# EAGLE design Walletv3 (EAGLE 9.1.3)

## Sheet 1 of 3
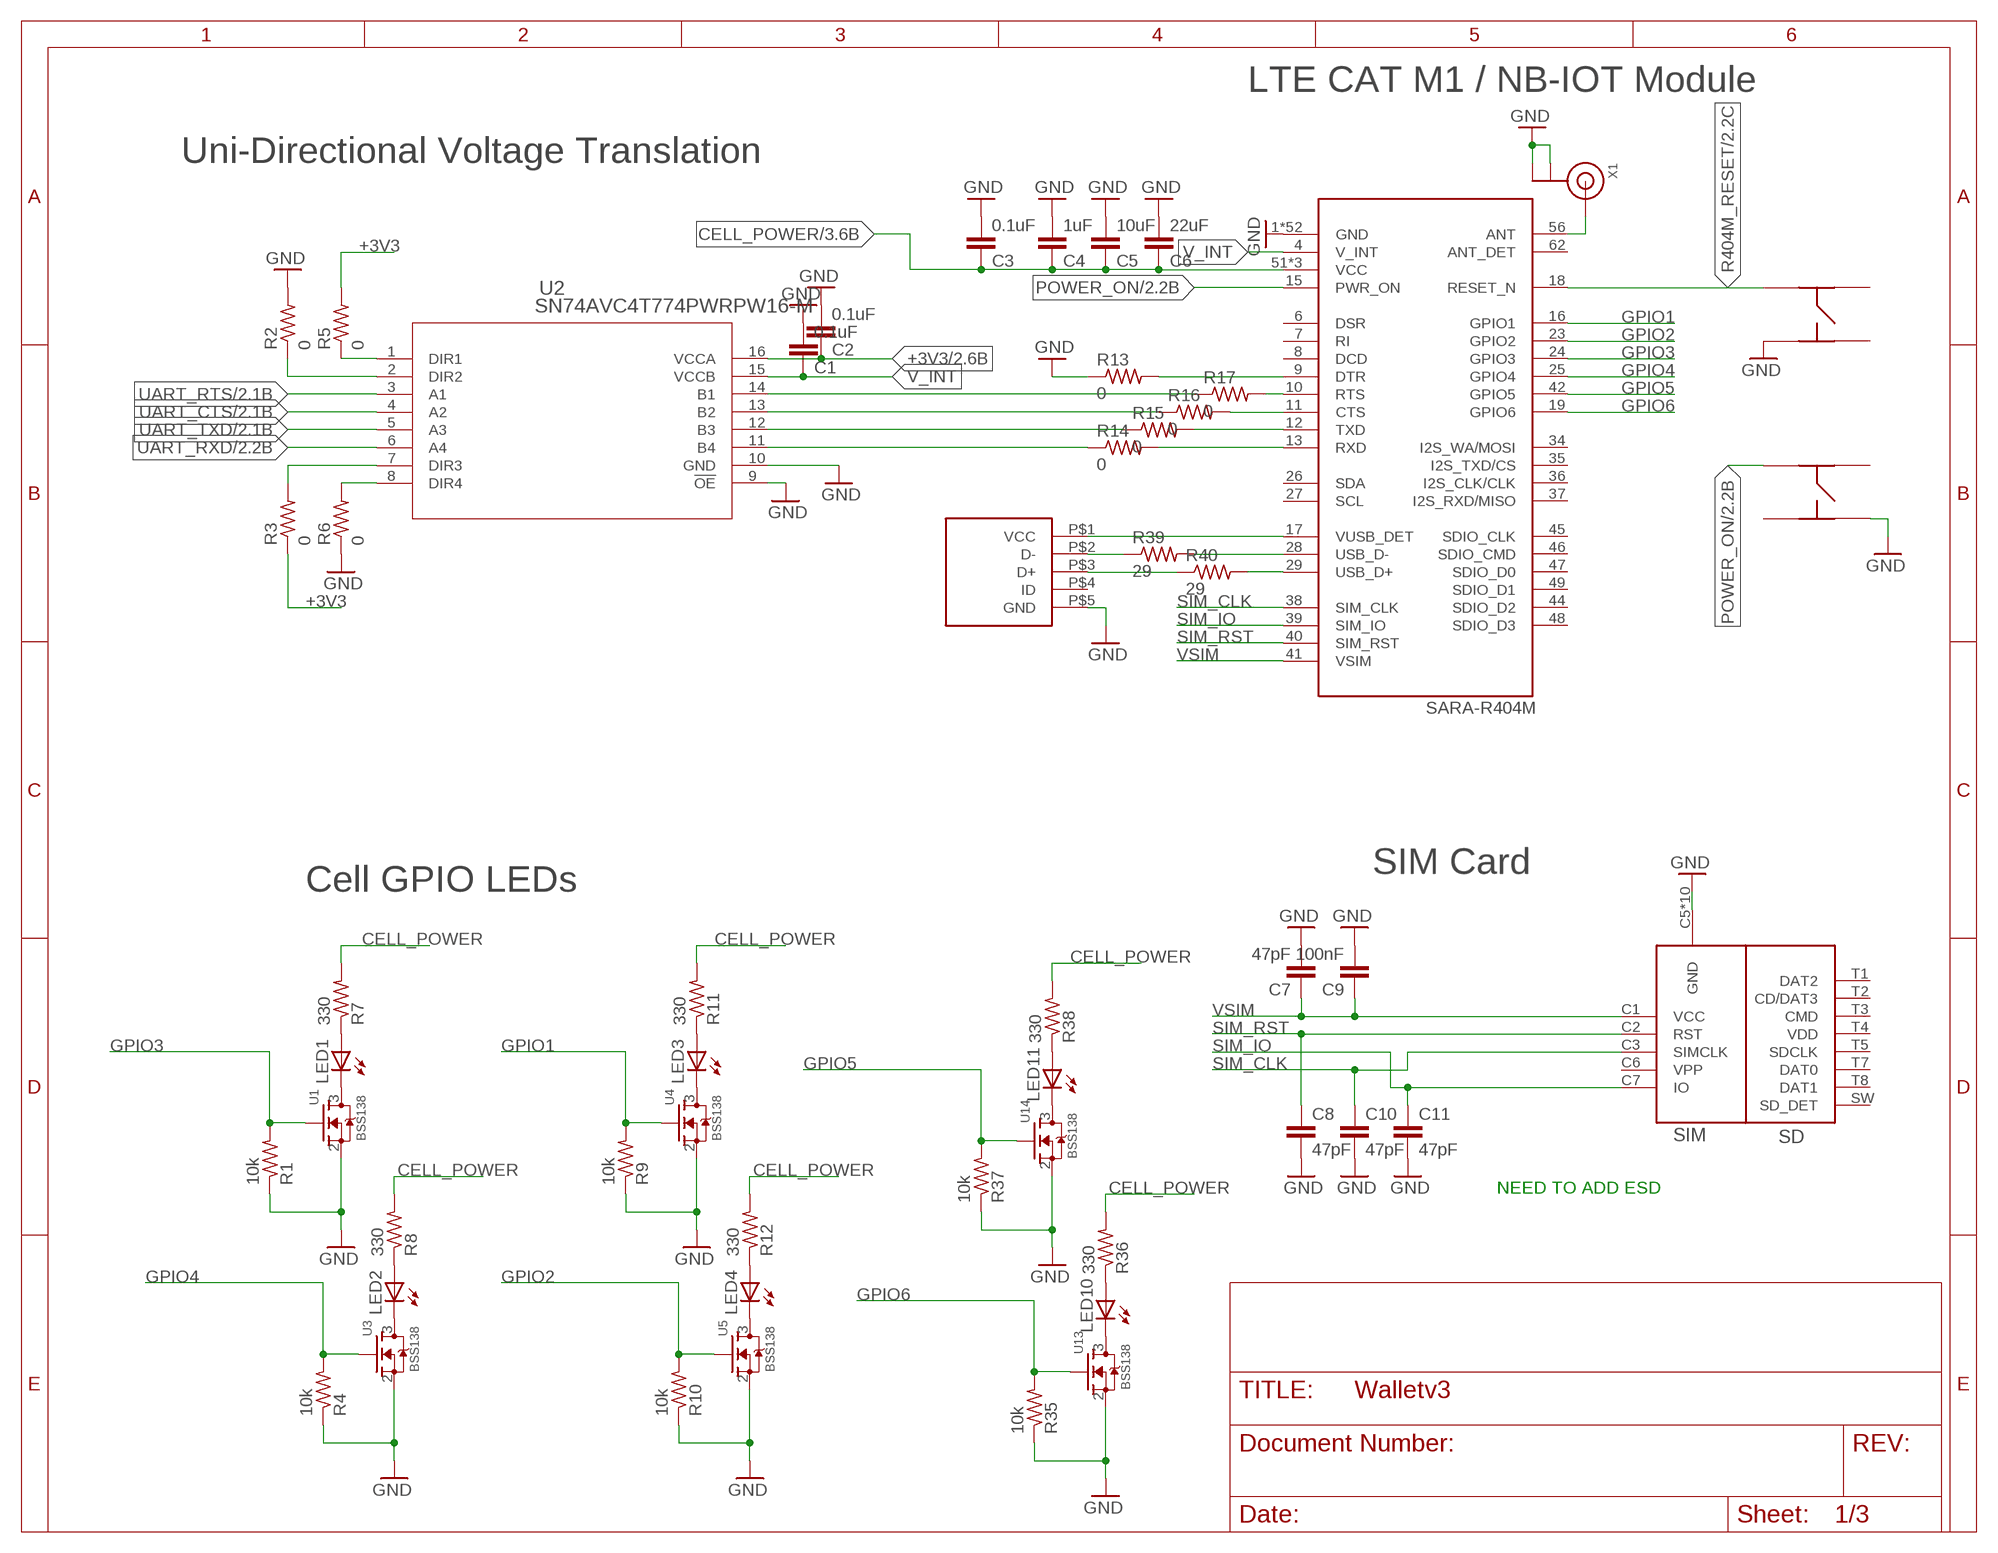
[diagram p0: schematic, sheet 1]

### Parts
C1  0.1uF  C-EUC0402  [C0402]
C2  0.1uF  C-EUC0402  [C0402]
C3  0.1uF  C-EUC0402  [C0402]
C4  1uF  C-EUC0402  [C0402]
C5  10uF  C-EUC0603  [C0603]
C6  22uF  C-EUC0805  [C0805]
C7  47pF  C-EUC0402  [C0402]
C8  47pF  C-EUC0402  [C0402]
C9  100nF  C-EUC0402  [C0402]
C10  47pF  C-EUC0402  [C0402]
C11  47pF  C-EUC0402  [C0402]
LED1  LEDCHIPLED_0603  [CHIPLED_0603]
LED2  LEDCHIPLED_0603  [CHIPLED_0603]
LED3  LEDCHIPLED_0603  [CHIPLED_0603]
LED4  LEDCHIPLED_0603  [CHIPLED_0603]
LED10  LEDCHIPLED_0603  [CHIPLED_0603]
LED11  LEDCHIPLED_0603  [CHIPLED_0603]
R1  10k  R-US_R0402  [R0402]
R2  0  R-US_R0402  [R0402]
R3  0  R-US_R0402  [R0402]
R4  10k  R-US_R0402  [R0402]
R5  0  R-US_R0402  [R0402]
R6  0  R-US_R0402  [R0402]
R7  330  R-US_R0402  [R0402]
R8  330  R-US_R0402  [R0402]
R9  10k  R-US_R0402  [R0402]
R10  10k  R-US_R0402  [R0402]
R11  330  R-US_R0402  [R0402]
R12  330  R-US_R0402  [R0402]
R13  0  R-US_R0402  [R0402]
R14  0  R-US_R0402  [R0402]
R15  0  R-US_R0402  [R0402]
R16  0  R-US_R0402  [R0402]
R17  0  R-US_R0402  [R0402]
R35  10k  R-US_R0402  [R0402]
R36  330  R-US_R0402  [R0402]
R37  10k  R-US_R0402  [R0402]
R38  330  R-US_R0402  [R0402]
R39  29  R-US_R0402  [R0402]
R40  29  R-US_R0402  [R0402]
S1  KMR731NG  [KMR731NG]
S2  KMR731NG  [KMR731NG]
U1  BSS138  [SOT23-3]
U2  SN74AVC4T774PWRPW16-M  [PW16-M]
U3  BSS138  [SOT23-3]
U4  BSS138  [SOT23-3]
U5  BSS138  [SOT23-3]
U6  SARA-R404M  [SARA-R404M]
U13  BSS138  [SOT23-3]
U14  BSS138  [SOT23-3]
U$1  SIM_SD_MOLEX  [SIM_SD_MOLEX]
U$2  MICRO_USB  [MOLEX_USB]
X1  ANTENNA_U.FL  [U.FL]

### Nets
+3V3: C2.1 R3.1 R5.2 U2.16(VCCA) ; also sheet 2,3
CELL_POWER: C3.1 C4.1 C5.1 C6.1 R7.2 R8.2 R11.2 R12.2 R36.2 R38.2 U6.51(VCC) U6.52(VCC) U6.53(VCC) ; also sheet 3
GND: C1.2 C2.2 C3.2 C4.2 C5.2 C6.2 C7.2 C8.2 C9.2 C10.2 C11.2 R1.1 R2.2 R4.1 R6.1 R9.1 R10.1 R13.1 R35.1 R37.1 S1.P$4 S2.P$3 U1.2(S) U2.9(!OE) U2.10(GND) U3.2(S) U4.2(S) U5.2(S) U6.1(GND) U6.3(GND) U6.5(GND) U6.14(GND) U6.20(GND) U6.21(GND) U6.22(GND) U6.30(GND) U6.32(GND) U6.43(GND) U6.50(GND) U6.54(GND) U6.55(GND) U6.57(GND) U6.58(GND) U6.59(GND) U6.60(GND) U6.61(GND) U6.63(GND) U6.64(GND) U6.65(GND) U6.66(GND) U6.67(GND) U6.68(GND) U6.69(GND) U6.70(GND) U6.71(GND) U6.72(GND) U6.73(GND) U6.74(GND) U6.75(GND) U6.76(GND) U6.77(GND) U6.78(GND) U6.79(GND) U6.80(GND) U6.81(GND) U6.82(GND) U6.83(GND) U6.84(GND) U6.85(GND) U6.86(GND) U6.87(GND) U6.88(GND) U6.89(GND) U6.90(GND) U6.91(GND) U6.92(GND) U6.93(GND) U6.94(GND) U6.95(GND) U6.96(GND) U13.2(S) U14.2(S) U$1.C5(GND) U$1.G1(GND) U$1.G2(GND) U$1.G3(GND) U$1.G4(GND) U$1.G5(GND) U$1.G6(GND) U$1.G7(GND) U$1.G8(GND) U$1.T6(GND) U$2.P$5(GND) X1.1(GND) X1.2(GND) ; also sheet 2,3
GPIO1: R9.2 U4.1(G) U6.16(GPIO1)
GPIO2: R10.2 U5.1(G) U6.23(GPIO2)
GPIO3: R1.2 U1.1(G) U6.24(GPIO3)
GPIO4: R4.2 U3.1(G) U6.25(GPIO4)
GPIO5: R37.2 U6.42(GPIO5) U14.1(G)
GPIO6: R35.2 U6.19(GPIO6) U13.1(G)
N$1: U6.17(VUSB_DET) U$2.P$1(VCC)
N$2: R39.1 U$2.P$2(D-)
N$3: R40.1 U$2.P$3(D+)
N$4: LED1.C U1.3(D)
N$5: R2.1 U2.2(DIR2)
N$6: LED1.A R7.1
N$7: R15.2 U6.12(TXD)
N$8: R14.2 U6.13(RXD)
N$9: LED4.C U5.3(D)
N$11: LED4.A R12.1
N$12: U6.56(ANT) X1.3(SIGNAL)
N$13: R13.2 U6.9(DTR)
N$14: LED2.C U3.3(D)
N$15: LED2.A R8.1
N$17: LED3.C U4.3(D)
N$18: R16.2 U6.11(CTS)
N$19: R17.2 U6.10(RTS)
N$21: LED3.A R11.1
N$27: R17.1 U2.14(B1)
N$28: R16.1 U2.13(B2)
N$29: R15.1 U2.12(B3)
N$30: R14.1 U2.11(B4)
N$31: R5.1 U2.1(DIR1)
N$32: R3.2 U2.7(DIR3)
N$33: R6.2 U2.8(DIR4)
N$50: LED10.C U13.3(D)
N$51: LED10.A R36.1
N$52: LED11.C U14.3(D)
N$53: LED11.A R38.1
N$54: R39.2 U6.28(USB_D-)
N$55: R40.2 U6.29(USB_D+)
POWER_ON: S2.P$1 U6.15(PWR_ON) ; also sheet 2
R404M_RESET: S1.P$1 U6.18(RESET_N) ; also sheet 2
SIM_CLK: C10.1 U6.38(SIM_CLK) U$1.C3(SIMCLK)
SIM_IO: C11.1 U6.39(SIM_IO) U$1.C7(IO)
SIM_RST: C8.1 U6.40(SIM_RST) U$1.C2(RST)
UART_CTS: U2.4(A2) ; also sheet 2
UART_RTS: U2.3(A1) ; also sheet 2
UART_RXD: U2.6(A4) ; also sheet 2
UART_TXD: U2.5(A3) ; also sheet 2
V_INT: C1.1 U2.15(VCCB) U6.4(V_INT)
VSIM: C7.1 C9.1 U6.41(VSIM) U$1.C1(VCC)
Unconnected: S1.P$2 S1.P$3 S2.P$2 S2.P$4 U6.6(DSR) U6.7(RI) U6.8(DCD) U6.26(SDA) U6.27(SCL) U6.34(I2S_WA/MOSI) U6.35(I2S_TXD/CS) U6.36(I2S_CLK/CLK) U6.37(I2S_RXD/MISO) U6.44(SDIO_D2) U6.45(SDIO_CLK) U6.46(SDIO_CMD) U6.47(SDIO_D0) U6.48(SDIO_D3) U6.49(SDIO_D1) U6.62(ANT_DET) U$1.C6(VPP) U$1.SW(SD_DET) U$1.T1(DAT2) U$1.T2(CD/DAT3) U$1.T3(CMD) U$1.T4(VDD) U$1.T5(SDCLK) U$1.T7(DAT0) U$1.T8(DAT1) U$2.P$4(ID)

### Notes on the sheet
- LTE CAT M1 / NB-IOT Module
- Uni-Directional Voltage Translation
- SIM Card
- Cell GPIO LEDs
- NEED TO ADD ESD

## Sheet 2 of 3
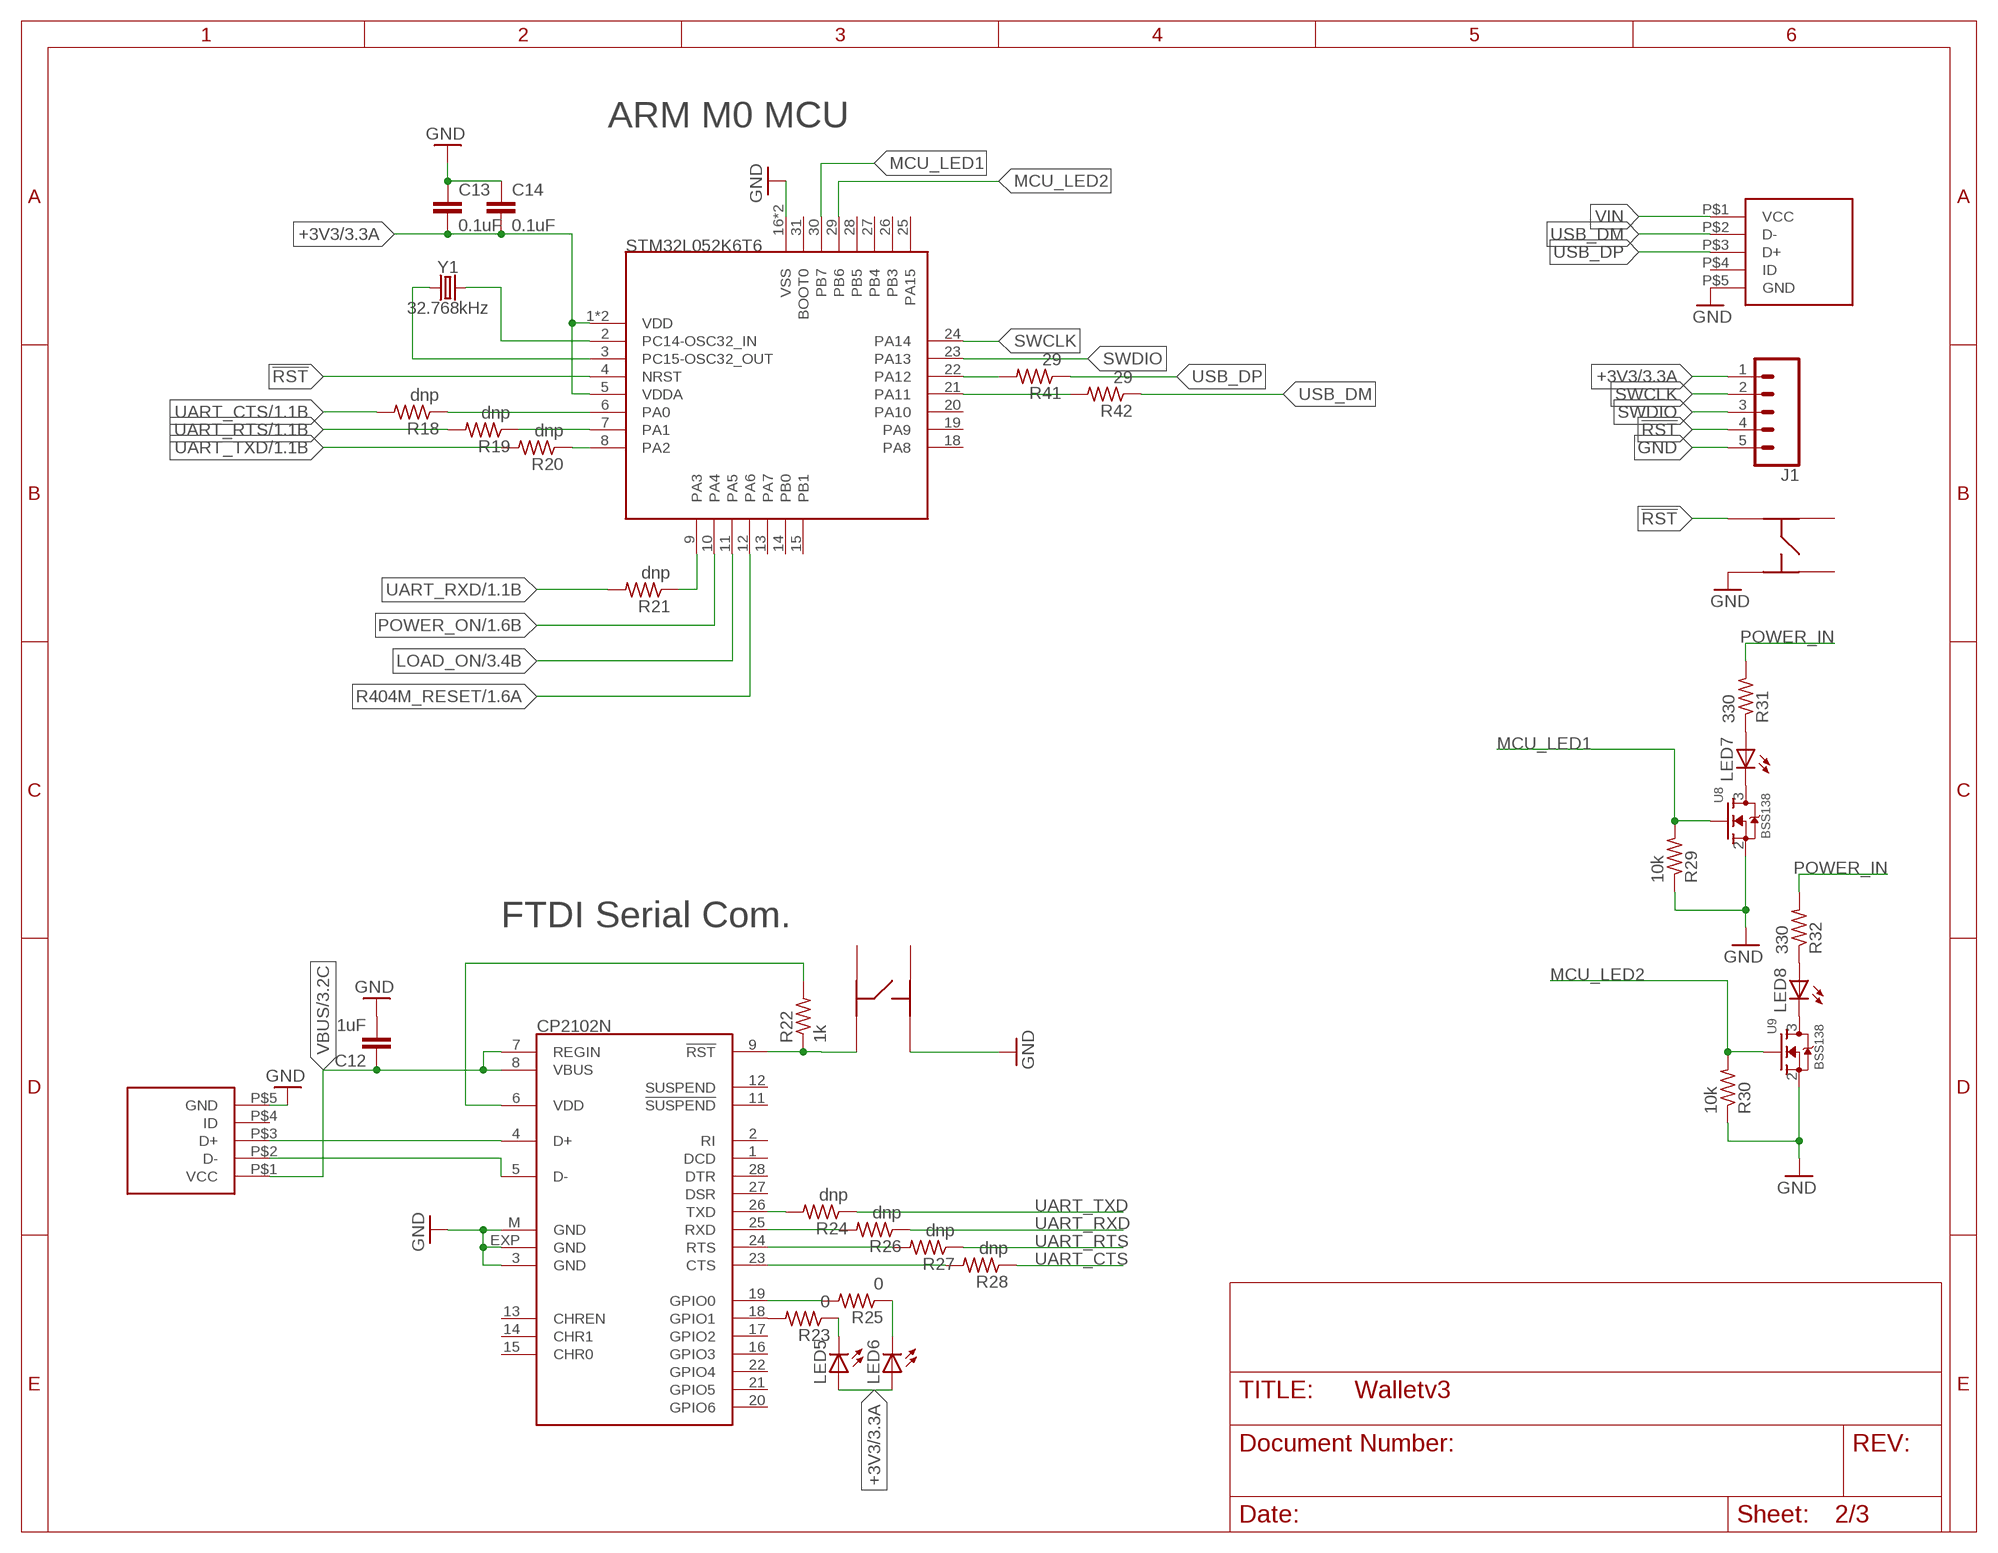
[diagram p1: schematic, sheet 2]

### Parts
C12  1uF  C-EUC0402  [C0402]
C13  0.1uF  C-EUC0402  [C0402]
C14  0.1uF  C-EUC0402  [C0402]
IC1  CP2102  [MLP28]
J1  CONN_05  [1X05]
LED5  LEDCHIPLED_0603  [CHIPLED_0603]
LED6  LEDCHIPLED_0603  [CHIPLED_0603]
LED7  LEDCHIPLED_0603  [CHIPLED_0603]
LED8  LEDCHIPLED_0603  [CHIPLED_0603]
R18  dnp  R-US_R0402  [R0402]
R19  dnp  R-US_R0402  [R0402]
R20  dnp  R-US_R0402  [R0402]
R21  dnp  R-US_R0402  [R0402]
R22  1k  R-US_R0402  [R0402]
R23  0  R-US_R0402  [R0402]
R24  dnp  R-US_R0402  [R0402]
R25  0  R-US_R0402  [R0402]
R26  dnp  R-US_R0402  [R0402]
R27  dnp  R-US_R0402  [R0402]
R28  dnp  R-US_R0402  [R0402]
R29  10k  R-US_R0402  [R0402]
R30  10k  R-US_R0402  [R0402]
R31  330  R-US_R0402  [R0402]
R32  330  R-US_R0402  [R0402]
R41  29  R-US_R0402  [R0402]
R42  29  R-US_R0402  [R0402]
S3  KMR731NG  [KMR731NG]
S4  KMR731NG  [KMR731NG]
U7  STM32L052K6T6LQFP32-7X7  [QFP80P900X900X160-32]
U8  BSS138  [SOT23-3]
U9  BSS138  [SOT23-3]
U$3  MICRO_USB  [MOLEX_USB]
U$4  MICRO_USB  [MOLEX_USB]
Y1  32.768kHz  CRYSTAL-32.768KHZSMD-3.2X1.5  [CRYSTAL-SMD-3.2X1.5MM]

### Nets
!RST: J1.4 S4.P$1 U7.4(NRST)
+3V3: C13.2 C14.2 J1.1 LED5.A LED6.A U7.1(VDD) U7.5(VDDA) U7.17(VDD) ; also sheet 1,3
D_N: IC1.5(D-) U$3.P$2(D-)
D_P: IC1.4(D+) U$3.P$3(D+)
GND: C12.2 C13.1 C14.1 IC1.3(GND) IC1.EXP(GND) IC1.M(GND) J1.5 R29.1 R30.1 S3.P$4 S4.P$4 U7.16(VSS) U7.32(VSS) U8.2(S) U9.2(S) U$3.P$5(GND) U$4.P$5(GND) ; also sheet 1,3
LOAD_ON: U7.11(PA5) ; also sheet 3
MCU_LED1: R29.2 U7.30(PB7) U8.1(G)
MCU_LED2: R30.2 U7.29(PB6) U9.1(G)
N$10: LED7.C U8.3(D)
N$16: LED7.A R31.1
N$23: LED8.C U9.3(D)
N$26: LED8.A R32.1
N$34: IC1.9(!RST) R22.1 S3.P$1
N$35: IC1.6(VDD) R22.2
N$36: LED6.C R25.1
N$37: IC1.18(GPIO1) R23.2
N$38: LED5.C R23.1
N$39: IC1.19(GPIO0) R25.2
N$40: IC1.26(TXD) R24.2
N$41: IC1.25(RXD) R26.2
N$42: R18.1 U7.6(PA0)
N$43: R19.1 U7.7(PA1)
N$44: IC1.24(RTS) R27.2
N$45: IC1.23(CTS) R28.2
N$46: R20.1 U7.8(PA2)
N$47: R21.1 U7.9(PA3)
N$48: U7.2(PC14-OSC32_IN) Y1.P$2
N$49: U7.3(PC15-OSC32_OUT) Y1.P$1
N$56: R41.2 U7.22(PA12)
N$57: R42.2 U7.21(PA11)
POWER_IN: R31.2 R32.2 ; also sheet 3
POWER_ON: U7.10(PA4) ; also sheet 1
R404M_RESET: U7.12(PA6) ; also sheet 1
SWCLK: J1.2 U7.24(PA14)
SWDIO: J1.3 U7.23(PA13)
UART_CTS: R18.2 R28.1 ; also sheet 1
UART_RTS: R19.2 R27.1 ; also sheet 1
UART_RXD: R21.2 R26.1 ; also sheet 1
UART_TXD: R20.2 R24.1 ; also sheet 1
USB_DM: R42.1 U$4.P$2(D-)
USB_DP: R41.1 U$4.P$3(D+)
VBUS: C12.1 IC1.7(REGIN) IC1.8(VBUS) U$3.P$1(VCC) ; also sheet 3
VIN: U$4.P$1(VCC)
Unconnected: IC1.1(DCD) IC1.2(RI) IC1.11(!SUSPEND) IC1.12(SUSPEND) IC1.13(CHREN) IC1.14(CHR1) IC1.15(CHR0) IC1.16(GPIO3) IC1.17(GPIO2) IC1.20(GPIO6) IC1.21(GPIO5) IC1.22(GPIO4) IC1.27(DSR) IC1.28(DTR) S3.P$2 S3.P$3 S4.P$2 S4.P$3 U7.13(PA7) U7.14(PB0) U7.15(PB1) U7.18(PA8) U7.19(PA9) U7.20(PA10) U7.25(PA15) U7.26(PB3) U7.27(PB4) U7.28(PB5) U7.31(BOOT0) U$3.P$4(ID) U$4.P$4(ID)

### Notes on the sheet
- ARM M0 MCU
- FTDI Serial Com.

## Sheet 3 of 3
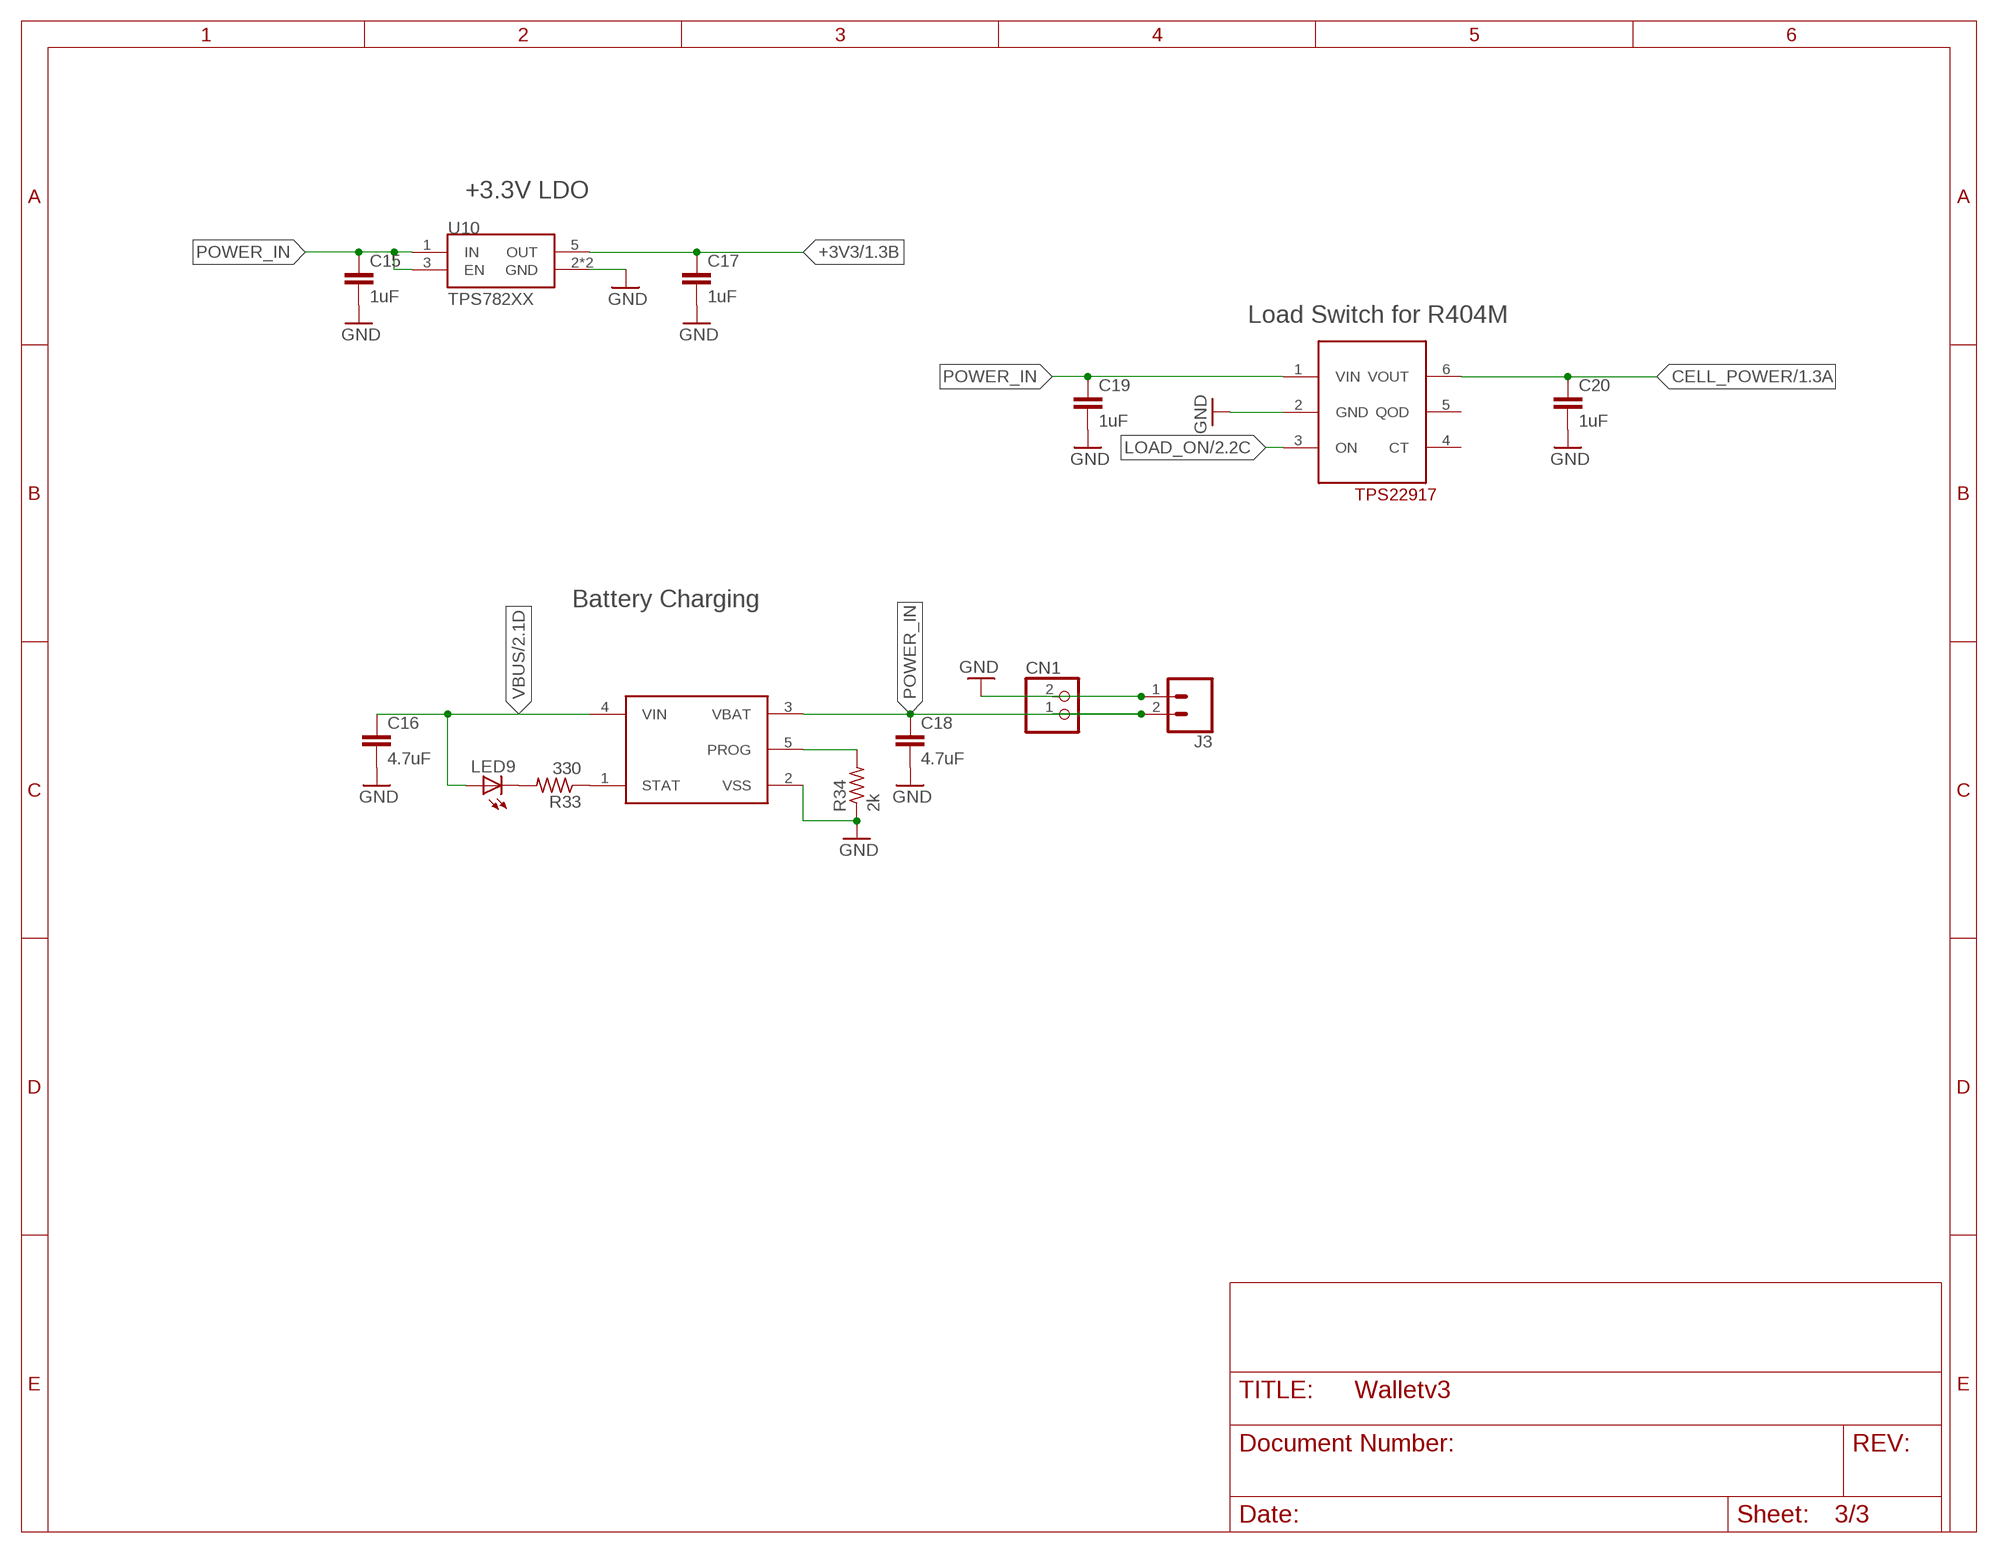
[diagram p2: schematic, sheet 3]

### Parts
C15  1uF  C-EUC0402  [C0402]
C16  4.7uF  C-EUC0603  [C0603]
C17  1uF  C-EUC0402  [C0402]
C18  4.7uF  C-EUC0603  [C0603]
C19  1uF  C-EUC0402  [C0402]
C20  1uF  C-EUC0402  [C0402]
CN1  JST_2PIN-SMT-RA  [JST-PH-2-SMT-RA]
J3  CONN_02  [1X02]
LED9  LEDCHIP-LED0603  [CHIP-LED0603]
R33  330  R-US_R0402  [R0402]
R34  2k  R-US_R0402  [R0402]
U10  TPS782XX  [SOT23-5L]
U11  MCP73831  [SOT23-5L]
U12  TPS22917  [SOT23-6]

### Nets
+3V3: C17.1 U10.5(OUT) ; also sheet 1,2
CELL_POWER: C20.1 U12.6(VOUT) ; also sheet 1
GND: C15.2 C16.2 C17.2 C18.2 C19.2 C20.2 CN1.2 J3.1 R34.1 U10.2(GND) U10.4(GND) U11.2(VSS) U12.2(GND) ; also sheet 1,2
LOAD_ON: U12.3(ON) ; also sheet 2
N$22: R34.2 U11.5(PROG)
N$24: R33.1 U11.1(STAT)
N$25: LED9.C R33.2
POWER_IN: C15.1 C18.1 C19.1 CN1.1 J3.2 U10.1(IN) U10.3(EN) U11.3(VBAT) U12.1(VIN) ; also sheet 2
VBUS: C16.1 LED9.A U11.4(VIN) ; also sheet 2
Unconnected: U12.4(CT) U12.5(QOD)

### Notes on the sheet
- +3.3V LDO
- Load Switch for R404M
- Battery Charging

## Library data of the parts
C1-C20 = rcl:C-EU: CAPACITOR, European symbol; SPICEPREFIX: C
CN1 = adafruit:JST_2PIN: JST 2-Pin Connectors of various flavors SMT-RA (S2B-PH-SM4) 4UConnector #17311 SMT (B2B-PH-SM4) THM-RA (S2B-PH) THM (B2B-PH)
IC1 = silabs:CP210*: Single-Chip USB to UART Bridge Source: www.silabs.com .. CP2101.pdf / cp2102.pdf; MF: FARNELL; MPN: CP2102-GM; OC_FARNELL: 9282130; OC_NEWARK: 30K5635
J1 = SparkFun-Connectors:CONN_05: Multi connection point. Often used as Generic Header-pin footprint for 0.1 inch spaced/style header connections On any of the 0.1 inch spaced packages, you can populate with these: Break Away Headers - Straight <https://www.sparkfun.com/products/116> (PRT-00116) Break Away Male Headers - Right Angle <https://www.sparkfun.com/products/553> (PRT-00553) Female Headers <https://www.sparkfun.com/products/115> (PRT-00115) Break Away Headers - Machine Pin <https://www.sparkfun.com/products/117> (PRT-00117) Break Away Female Headers - Swiss Machine Pin <https://www.sparkfun.com/products/743> (PRT-00743) For SCREWTERMINALS and SPRING TERMINALS visit here: Screw Terimnals on SparkFun.com <https://www.sparkfun.com/search/results?term=Screw+Terminals> (5mm/3.5mm/2.54mm spacing) This device is also useful as a general connection point to wire up your design to another part of your project. Our various solder wires solder well into these plated through hole pads. Hook-Up Wire - Assortment (Stranded, 22 AWG) <https://www.sparkfun.com/products/11375> (PRT-11375) Hook-Up Wire - Assortment (Solid Core, 22 AWG) <https://www.sparkfun.com/products/11367> (PRT-11367) View the entire wire category on our website here <https://www.sparkfun.com/categories/141> Special notes: Molex polarized connector foot print use with SKU : PRT-08231 with associated crimp pins and housings. 1MM SMD Version SKU: PRT-10208
J3 = SparkFun-Connectors:CONN_02: Multi connection point. Often used as Generic Header-pin footprint for 0.1 inch spaced/style header connections On any of the 0.1 inch spaced packages, you can populate with these: Break Away Headers - Straight <https://www.sparkfun.com/products/116> (PRT-00116) Break Away Male Headers - Right Angle <https://www.sparkfun.com/products/553> (PRT-00553) Female Headers <https://www.sparkfun.com/products/115> (PRT-00115) Break Away Headers - Machine Pin <https://www.sparkfun.com/products/117> (PRT-00117) Break Away Female Headers - Swiss Machine Pin <https://www.sparkfun.com/products/743> (PRT-00743) For SCREWTERMINALS and SPRING TERMINALS visit here: Screw Terimnals on SparkFun.com <https://www.sparkfun.com/search/results?term=Screw+Terminals> (5mm/3.5mm/2.54mm spacing) This device is also useful as a general connection point to wire up your design to another part of your project. Our various solder wires solder well into these plated through hole pads. Hook-Up Wire - Assortment (Stranded, 22 AWG) <https://www.sparkfun.com/products/11375> (PRT-11375) Hook-Up Wire - Assortment (Solid Core, 22 AWG) <https://www.sparkfun.com/products/11367> (PRT-11367) View the entire wire category on our website here <https://www.sparkfun.com/categories/141> Special notes: Molex polarized connector foot print use with: PRT-08233 with associated crimp pins and housings. 2.54_SCREWTERM for use with PRT-10571. 3.5mm Screw Terminal footprints for PRT-08084 5mm Screw Terminal footprints for use with PRT-08432
LED1-LED11 = adafruit:LED: LED OSRAM: - CHIPLED LG R971, LG N971, LY N971, LG Q971, LY Q971, LO R971, LY R971 LH N974, LH R974 LS Q976, LO Q976, LY Q976 LO Q996 - Hyper CHIPLED LW Q18S LB Q993, LB Q99A, LB R99A - SideLED LS A670, LO A670, LY A670, LG A670, LP A670 LB A673, LV A673, LT A673, LW A673 LH A674 LY A675 LS A676, LA A676, LO A676, LY A676, LW A676 LS A679, LY A679, LG A679 - Hyper Micro SIDELED® LS Y876, LA Y876, LO Y876, LY Y876 LT Y87S - SmartLED LW L88C, LW L88S LB L89C, LB L89S, LG L890 LS L89K, LO L89K, LY L89K LS L896, LA L896, LO L896, LY L896 - TOPLED LS T670, LO T670, LY T670, LG T670, LP T670 LSG T670, LSP T670, LSY T670, LOP T670, LYG T670 LG T671, LOG T671, LSG T671 LB T673, LV T673, LT T673, LW T673 LH T674 LS T676, LA T676, LO T676, LY T676, LB T676, LH T676, LSB T676, LW T676 LB T67C, LV T67C, LT T67C, LS T67K, LO T67K, LY T67K, LW E67C LS E67B, LA E67B, LO E67B, LY E67B, LB E67C, LV E67C, LT E67C LW T67C LS T679, LY T679, LG T679 LS T770, LO T770, LY T770, LG T770, LP T770 LB T773, LV T773, LT T773, LW T773 LH T774 LS E675, LA E675, LY E675, LS T675 LS T776, LA T776, LO T776, LY T776, LB T776 LHGB T686 LT T68C, LB T68C - Hyper Mini TOPLED® LB M676 - Mini TOPLED Santana® LG M470 LS M47K, LO M47K, LY M47K Source: http://www.osram.convergy.de/
R1-R42 = rcl:R-US_: RESISTOR, American symbol; SPICEPREFIX: R
S1-S4 = Charles:KMR731NG: Tactile Switch SPST-NO Top Actuated Surface Mount
U1 U3-U5 U8 U9 U13 U14 = Charles:BSS138: MOSFET N-CH 50V 220MA
U2 = Charles:SN74AVC4T774PWR: 4-Bit Dual-Supply Bus Transceiver With Configurable Voltage Translation and 3-State Outputs; MANUFACTURER_PART_NUMBER: SN74AVC4T774PWR; VENDOR: Texas Instruments
U6 = Charles:SARA-R404M
U7 = Charles:STM32L052K6T6: ARM® Cortex®-M0+ STM32L0 Microcontroller IC 32-Bit 32MHz 32KB (32K x 8) FLASH 32-LQFP (7x7)
U10 = James_Updated:TPS782XX: TPS782 500-nA IQ,150-mA, Ultra-Low Quiescent Current Low-Dropout Linear Regulator
U11 = James_Updated:MCP73831
U12 = Charles:TPS22917: 1 V–5.5-V, 2-A, 80-mΩ Ultra-Low Leakage Load Switch
U$1 = Charles:SIM_SD_MOLEX
U$2-U$4 = James_Updated:MICRO_USB: Molex Micro USB AB RA SMD Bottom Mount
X1 = adafruit:ANTENNA_U.FL: U.FL Antenna Connector
Y1 = SparkFun-Clocks:CRYSTAL-32.768KHZ: 32.768kHz Crystal Frequency: 32.768kHz Frequency Stability: ±20ppm Load Capacitance: 12.5pF (PTH-2X6 & SMD-3.2X1.5), 6pF (SMD-2X6) SparkFun Products: SparkFun BigTime Watch Kit <https://www.sparkfun.com/products/11734> SparkFun nRF52832 Breakout <https://www.sparkfun.com/products/13990> SparkFun Real Time Clock Module <https://www.sparkfun.com/products/12708>; PROD_ID: XTAL-13062

## Board
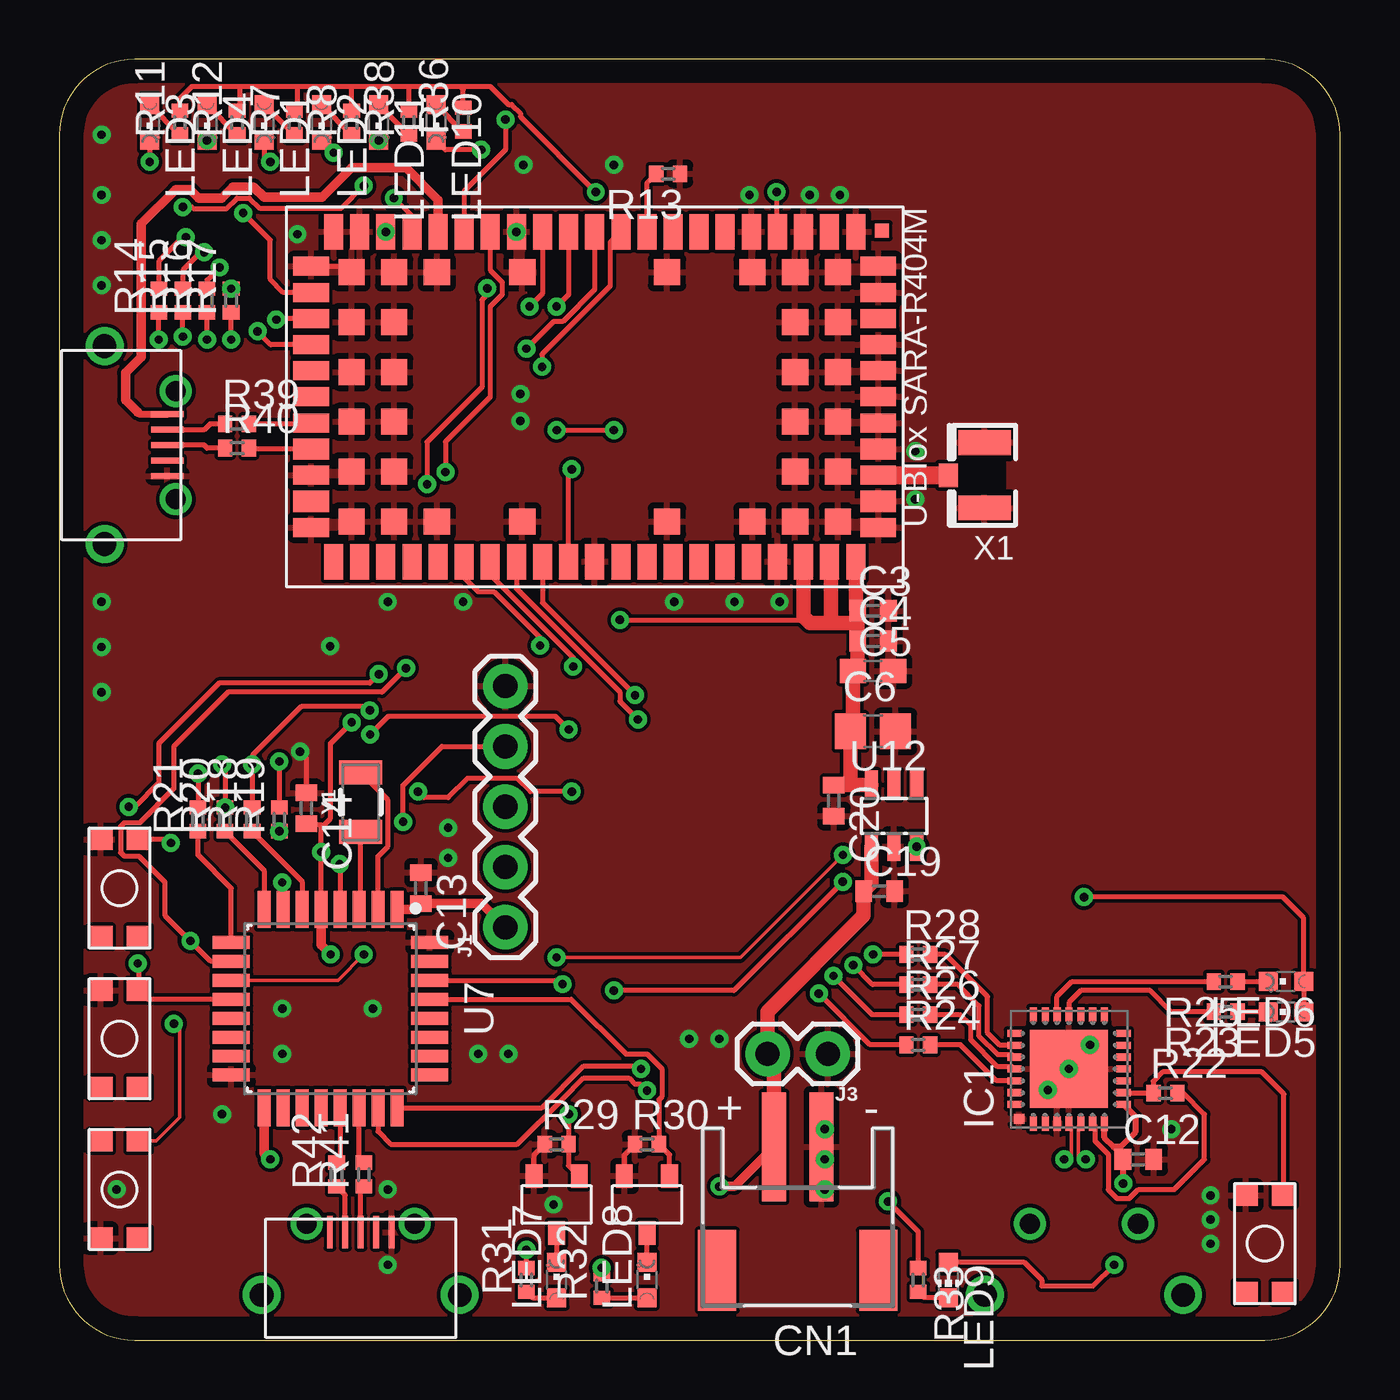
[diagram p3: board, top side]
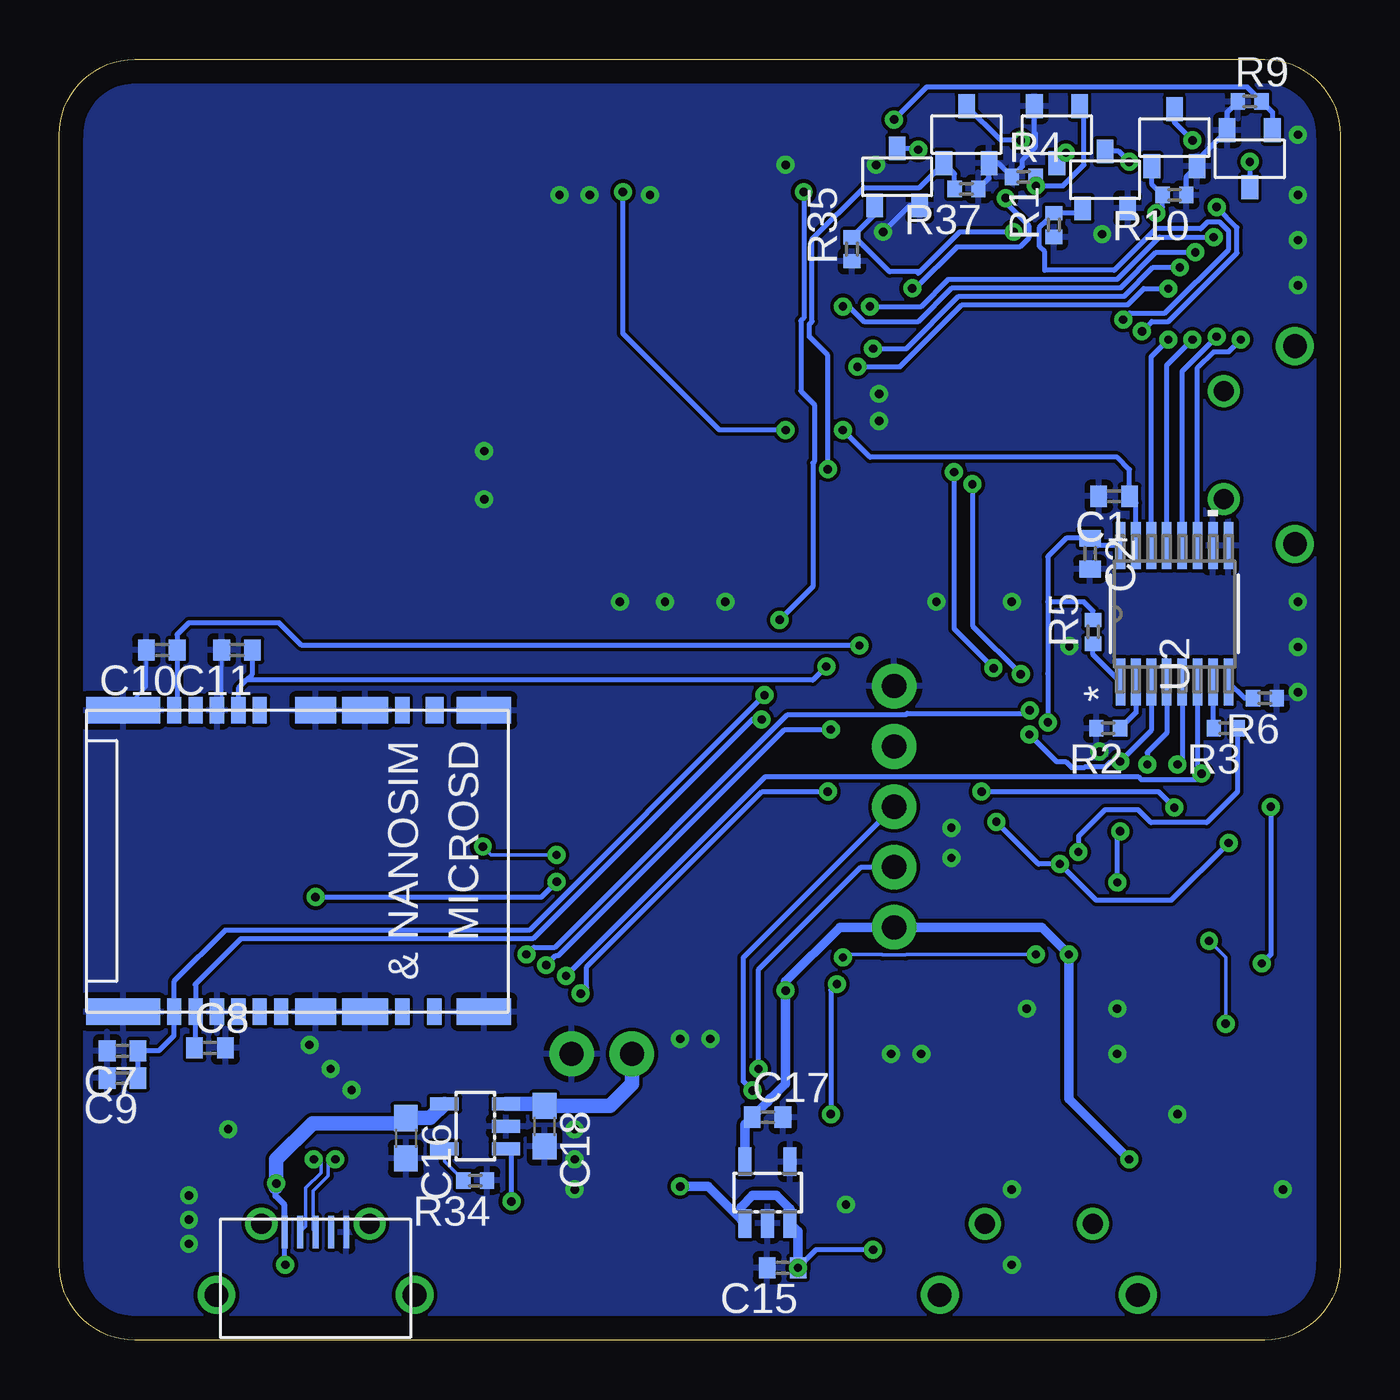
[diagram p4: board, bottom side, seen from below]

Size 53.98 x 53.98 mm. Coordinates in mm from the lower left corner, seen from the top.
Outline: 3.17,0 50.8,0 arc90 53.98,3.17 53.98,50.8 arc90 50.8,53.98 3.17,53.98 arc90 0,50.8 0,3.17 arc90 3.17,0
Copper layers (1*16): Top 0.035mm / dielectric 1.5mm / Bottom 0.035mm
Design rules "default": minimum track width 6mil, minimum drill 0.35mm, track to track 6mil, track to pad 6mil, pad to pad 6mil, via to via 6mil, smd to smd 6mil, copper to edge 40mil, drill to drill 6mil, minimum pad ring 10mil, minimum via ring 8mil, stop-mask expansion 4mil, vias tented up to drill 0mil, thermal gap 10mil

### Footprints (pad centres in the part's own frame; a part is rotated, then mirrored left to right if it is on the bottom)
C0402 = smd 0.7 x 0.9: 1 -0.65,0; 2 0.65,0
C0603 = smd 1.1 x 1: 1 -0.85,0; 2 0.85,0
C0805 = smd 1.3 x 1.5: 1 -0.95,0; 2 0.95,0
JST-PH-2-SMT-RA = smd 1 x 4.6: 1 1,-3.7; 2 -1,-3.7 | smd 1.6 x 3.4: NC1 -3.4,1.5; NC2 3.4,1.5
MLP28 = smd 0.6 x 0.3: 1 -2.3,1.5; 2 -2.3,1; 3 -2.3,0.5; 4 -2.3,0; 5 -2.3,-0.5; 6 -2.3,-1; 7 -2.3,-1.5; 15 2.3,-1.5; 16 2.3,-1; 17 2.3,-0.5; 18 2.3,0; 19 2.3,0.5; 20 2.3,1; 21 2.3,1.5 | smd 0.3 x 0.6: 8 -1.5,-2.3; 9 -1,-2.3; 10 -0.5,-2.3; 11 0,-2.3; 12 0.5,-2.3; 13 1,-2.3; 14 1.5,-2.3; 22 1.5,2.3; 23 1,2.3; 24 0.5,2.3; 25 0,2.3; 26 -0.5,2.3; 27 -1,2.3; 28 -1.5,2.3 | smd 3.3 x 3.3: EXP 0,0 | smd 0.435 x 0.435: M -2.103,2.103
1X05 = drill 1.016 pad 1.88: 1 0,0; 2 2.54,0; 3 5.08,0; 4 7.62,0; 5 10.16,0
1X02 = drill 1.016 pad 1.88: 1 0,0; 2 2.54,0
CHIPLED_0603 = smd 0.8 x 0.8: A 0,-0.75; C 0,0.75
CHIP-LED0603 = smd 0.8 x 0.8: A 0,-0.75; C 0,0.75
R0402 = smd 0.6 x 0.7: 1 -0.5,0; 2 0.5,0
KMR731NG = smd 0.9 x 1: P$1 -2.05,0.8; P$2 2.05,0.8; P$3 2.05,-0.8; P$4 -2.05,-0.8
SOT23-3 = smd 0.7 x 1: 1 -0.95,-1.2; 2 0.95,-1.2; 3 0,1.2
PW16-M = smd 1.981 x 0.406: 1 -2.87,2.275; 2 -2.87,1.625; 3 -2.87,0.975; 4 -2.87,0.325; 5 -2.87,-0.325; 6 -2.87,-0.975; 7 -2.87,-1.625; 8 -2.87,-2.275; 9 2.87,-2.275; 10 2.87,-1.625; 11 2.87,-0.975; 12 2.87,-0.325; 13 2.87,0.325; 14 2.87,0.975; 15 2.87,1.625; 16 2.87,2.275
SARA-R404M = smd 1.5 x 0.8: 1 1.05,-2; 2 1.05,-3.1; 3 1.05,-4.2; 4 1.05,-5.3; 5 1.05,-6.4; 6 1.05,-7.5; 7 1.05,-8.6; 8 1.05,-9.7; 9 1.05,-10.8; 10 1.05,-11.9; 11 1.05,-13; 12 1.05,-14.1; 13 1.05,-15.2; 14 1.05,-16.3; 15 1.05,-17.4; 16 1.05,-18.5; 17 1.05,-19.6; 18 1.05,-20.7; 19 1.05,-21.8; 20 1.05,-22.9; 21 1.05,-24; 33 14.95,-24; 34 14.95,-22.9; 35 14.95,-21.8; 36 14.95,-20.7; 37 14.95,-19.6; 38 14.95,-18.5; 39 14.95,-17.4; 40 14.95,-16.3; 41 14.95,-15.2; 42 14.95,-14.1; 43 14.95,-13; 44 14.95,-11.9; 45 14.95,-10.8; 46 14.95,-9.7; 47 14.95,-8.6; 48 14.95,-7.5; 49 14.95,-6.4; 50 14.95,-5.3; 51 14.95,-4.2; 52 14.95,-3.1; 53 14.95,-2 | smd 0.8 x 1.5: 22 2.5,-24.95; 23 3.6,-24.95; 24 4.7,-24.95; 25 5.8,-24.95; 26 6.9,-24.95; 27 8,-24.95; 28 9.1,-24.95; 30 11.3,-24.95; 32 13.5,-24.95; 54 13.5,-1.05; 56 11.3,-1.05; 58 9.1,-1.05; 59 8,-1.05; 60 6.9,-1.05; 61 5.8,-1.05; 62 4.7,-1.05; 63 3.6,-1.05; 64 2.5,-1.05 | smd 0.9 x 1.5: 29 10.2,-24.95; 31 12.4,-24.95; 55 12.4,-1.05; 57 10.2,-1.05 | smd 1.1 x 1.1: 65 2.75,-2.75; 66 4.85,-2.75; 67 6.95,-2.75; 68 9.05,-2.75; 69 11.15,-2.75; 70 13.25,-2.75; 71 2.75,-4.55; 72 4.85,-4.55; 73 6.95,-4.55; 74 9.05,-4.55; 75 11.15,-4.55; 76 13.25,-4.55; 77 2.75,-6.35; 78 13.25,-6.35; 79 2.75,-9.95; 80 13.25,-9.95; 81 2.75,-16.05; 82 13.25,-16.05; 83 2.75,-19.65; 84 13.25,-19.65; 85 2.75,-21.45; 86 4.85,-21.45; 87 6.95,-21.45; 88 9.05,-21.45; 89 11.15,-21.45; 90 13.25,-21.45; 91 2.75,-23.25; 92 4.85,-23.25; 93 6.95,-23.25; 94 9.05,-23.25; 95 11.15,-23.25; 96 13.25,-23.25 | smd 0.6 x 0.6: P$1 1,-0.9
QFP80P900X900X160-32 = smd 1.559 x 0.547: 1 -4.178,2.8; 2 -4.178,2; 3 -4.178,1.2; 4 -4.178,0.4; 5 -4.178,-0.4; 6 -4.178,-1.2; 7 -4.178,-2; 8 -4.178,-2.8; 17 4.178,-2.8; 18 4.178,-2; 19 4.178,-1.2; 20 4.178,-0.4; 21 4.178,0.4; 22 4.178,1.2; 23 4.178,2; 24 4.178,2.8 | smd 0.547 x 1.559: 9 -2.8,-4.178; 10 -2,-4.178; 11 -1.2,-4.178; 12 -0.4,-4.178; 13 0.4,-4.178; 14 1.2,-4.178; 15 2,-4.178; 16 2.8,-4.178; 25 2.8,4.178; 26 2,4.178; 27 1.2,4.178; 28 0.4,4.178; 29 -0.4,4.178; 30 -1.2,4.178; 31 -2,4.178; 32 -2.8,4.178
SOT23-5L = smd 0.55 x 1.2: 1 -0.95,-1.3; 2 0,-1.3; 3 0.95,-1.3; 4 0.95,1.3; 5 -0.95,1.3
SOT23-6 = smd 0.55 x 1.2: 1 -0.95,-1.3; 2 0,-1.3; 3 0.95,-1.3; 4 0.95,1.3; 5 0,1.3; 6 -0.95,1.3
SIM_SD_MOLEX = smd 1.1 x 0.6: C1 6.35,3.7; C2 6.35,4.6; C3 -6.35,3.7; C5 6.35,5.5; C6 -6.35,4.6; C7 -6.35,6.4; T1 6.35,14.665; T2 6.35,13.31; T3 6.35,8.2; T4 6.35,7.3; T5 6.35,6.4; T6 -6.35,5.5; T7 -6.35,7.3; T8 -6.35,13.31 | smd 1.1 x 3.1: G1 -6.35,1.55; G8 6.35,1.55 | smd 1.1 x 1.72: G2 -6.35,9.66; G7 6.35,9.66 | smd 1.1 x 1.94: G3 -6.35,11.74; G6 6.35,11.74 | smd 1.1 x 2.3: G4 -6.35,16.75; G5 6.35,16.75 | smd 1.1 x 0.75: SW -6.35,14.665
MOLEX_USB = smd 0.25 x 1.35: P$1 -1.3,2.65; P$2 -0.65,2.65; P$3 0,2.65; P$4 0.65,2.65; P$5 1.3,2.65 | drill 0.85 pad 1.206: P$6 -2.276,3; P$7 2.276,3 | drill 1 pad 1.6: P$8 -4.175,0; P$9 4.175,0
U.FL = smd 2.2 x 1.05: 1 0,1.375; 2 0,-1.375 | smd 0.8 x 1: 3 1.525,0
CRYSTAL-SMD-3.2X1.5MM = smd 1 x 1.8: P$1 -1.25,0; P$2 1.25,0

### Placement (x,y rotation side)
C1  9.53,35.56 180 bottom
C2  10.54,33.15 270 bottom
C3  34.29,30.73 0 top
C4  34.29,29.46 0 top
C5  34.29,28.19 0 top
C6  34.29,25.65 0 top
C7  51.31,12.19 180 bottom
C8  47.62,12.32 0 bottom
C9  51.31,11.05 180 bottom
C10  49.66,29.08 180 bottom
C11  46.48,29.08 180 bottom
C12  45.47,7.62 0 top
C13  15.24,19.05 270 top
C14  10.41,22.42 270 top
C15  23.5,3.05 180 bottom
C16  39.37,8.51 270 bottom
C17  24.13,9.4 0 bottom
C18  33.53,9.02 270 bottom
C19  34.54,18.92 0 top
C20  32.64,22.73 270 top
CN1  31.11,4.45 180 top
IC1  42.55,11.43 90 top
J1  18.8,17.4 90 top
J3  32.38,12.06 180 top
LED1  8.64,51.31 180 top
LED2  11.05,51.31 180 top
LED3  3.81,51.31 180 top
LED4  6.22,51.31 180 top
LED5  51.69,13.84 90 top
LED6  51.69,15.11 90 top
LED7  20.95,2.54 0 top
LED8  24.77,2.54 0 top
LED9  37.47,2.54 180 top
LED10  15.88,51.31 180 top
LED11  13.46,51.31 180 top
R1  12.06,46.99 90 bottom
R2  9.78,25.78 180 bottom
R3  4.83,25.78 180 bottom
R4  13.34,49.02 0 bottom
R5  10.41,29.84 90 bottom
R6  3.17,27.05 180 bottom
R7  9.91,51.31 90 top
R8  12.32,51.31 90 top
R9  3.81,52.2 0 bottom
R10  6.99,48.26 180 bottom
R11  5.08,51.31 90 top
R12  7.49,51.31 90 top
R13  25.65,49.15 180 top
R14  4.19,43.81 90 top
R15  5.21,43.81 90 top
R16  6.22,43.81 90 top
R17  7.24,43.81 90 top
R18  8.13,21.94 90 top
R19  9.27,21.94 90 top
R20  6.99,21.94 90 top
R21  5.84,21.94 90 top
R22  46.61,10.41 0 top
R23  49.15,13.84 180 top
R24  36.2,12.45 0 top
R25  49.15,15.11 180 top
R26  36.2,13.72 0 top
R27  36.2,14.99 0 top
R28  36.2,16.26 0 top
R29  20.95,8.26 0 top
R30  24.77,8.26 0 top
R31  19.68,2.54 90 top
R32  22.86,2.29 90 top
R33  36.2,2.54 270 top
R34  36.45,6.73 180 bottom
R35  20.57,45.97 90 bottom
R36  17.02,51.44 90 top
R37  15.75,48.51 180 bottom
R38  14.73,51.31 90 top
R39  7.49,38.61 0 top
R40  7.49,37.59 0 top
R41  12.83,6.99 90 top
R42  11.68,6.99 90 top
S1  2.54,12.7 270 top
S2  2.54,6.35 270 top
S3  50.8,4.06 270 top
S4  2.54,19.05 270 top
U1  9.91,48.9 0 bottom
U2  6.99,30.61 90 bottom
U3  11.94,50.8 180 bottom
U4  3.81,49.78 180 bottom
U5  6.99,50.67 0 bottom
U6  35.56,47.75 270 top
U7  11.43,13.97 270 top
U8  20.95,5.71 180 top
U9  24.77,5.71 180 top
U10  24.13,6.22 0 bottom
U11  36.45,9.02 90 bottom
U12  35.18,22.1 0 top
U13  18.67,49.02 0 bottom
U14  15.75,50.8 0 bottom
U$1  52.83,20.19 270 bottom
U$2  1.91,37.72 270 top
U$3  43.18,1.91 0 bottom
U$4  12.7,1.91 0 top
X1  38.99,36.45 180 top
Y1  12.7,22.67 90 top

### Tracks (layer width: path | path; a pad name or v marks a point on that pad's centre or on a via)
!RST  (via drill 0.35)
  Top 0.203: U7.4 11.83,20.05 v11.81,20.07 | v4.7,20.95 4.55,21.1 S4.P$1 | v14.49,21.84 14.49,22.85 14.48,22.85 14.48,23.38 16.12,25.02 J1.4
  Bottom 0.203: v4.7,20.95 7.11,18.54 10.29,18.54 v11.81,20.07 12.71,20.07 v14.49,21.84
+3V3  (via drill 0.35)
  Top 0.203: U7.5 v11.03,20.57 11.03,21.59 | 11.03,21.59 11.03,21.72 10.46,21.72 C14.2 | 15.12,18.28 C13.2 | LED5.A LED6.A 52.44,17.79 51.56,18.67 v43.18,18.67 | v33.01,19.32 28.43,14.73 v23.37,14.73 | 11.03,21.59 11.43,21.99 11.43,25.15 v12.32,26.04
  Top 0.406: C13.2 17.8,18.4 J1.1 | U7.1 14.99,18.15 15.12,18.28 | U7.5 11.03,16.66 v11.43,16.26 | U7.17 8.63,7.88 v8.89,7.62
  Bottom 0.203: U2.16 10.22,33.48 C2.1 11.54,33.8 12.32,33.02 12.32,31.11 | v43.18,18.67 33.66,18.67 v33.01,19.32 | 12.32,31.11 12.32,28.07 12.31,28.07 v12.31,26.04 v12.32,26.04 | R3.1 4.33,23.11 5.62,21.81 7.97,21.81 8.51,22.35 9.91,22.35 11.03,21.23 v11.03,20.57 | R5.2 10.41,30.73 10.79,31.11 12.32,31.11
  Bottom 0.406: U10.5 25.08,9.1 C17.1 24.19,9.99 23.98,10.2 23.97,10.2 23.37,10.81 v23.37,14.73 23.37,15.11 21.08,17.4 J1.1 12.57,17.4 v11.43,16.26 11.43,10.16 v8.89,7.62
CELL_POWER  (via drill 0.35)
  Top 0.203: R11.2 5.08,52.32 5.59,52.83 7.62,52.83 | 7.62,52.83 10.03,52.83 | 10.03,52.83 12.32,52.83 | 12.32,52.83 14.73,52.83 | 14.73,52.83 16.89,52.83 | 16.89,52.83 18.16,52.83 18.93,52.07 19.06,52.07 19.43,51.7 19.43,51.56 v22.61,48.39 | R36.2 17.02,52.7 16.89,52.83 | R38.2 14.73,52.83 | R8.2 12.32,52.83 | R7.2 10.03,51.94 10.03,52.83 | R12.2 7.62,51.94 7.62,52.83 | v23.62,30.35 31.22,30.35 31.36,30.49
  Top 0.61: U12.6 33.4,23.4 | 33.4,23.4 32.65,23.4 C20.1 | C6.1 33.34,25.15 | 33.34,25.15 33.34,23.46 33.4,23.4 | 33.34,25.15 33.44,25.25 C5.1 33.64,28.39 C4.1 33.64,30.23 | 33.64,30.23 C3.1 33.56,30.81 U6.53 | U6.51 31.36,30.49 31.62,30.23 32.51,30.23 | 32.51,30.23 33.64,30.23 | U6.52 32.51,32.75 32.51,30.23
  Bottom 0.203: v22.61,48.39 22.61,43.07 22.73,42.95 22.73,40 22.16,39.43 22.16,37.03 22.22,36.97 22.22,31.75 v23.62,30.35
D_N  (via drill 0.35)
  Top 0.152: v43.25,7.62 42.95,7.62 42.95,9.04 IC1.5
  Bottom 0.152: U$3.P$2 43.59,4.8 43.59,6.41 42.95,7.05 42.95,7.62 v43.25,7.62
D_P  (via drill 0.35)
  Top 0.152: v42.34,7.62 42.65,7.62 42.65,9.03 IC1.4
  Bottom 0.152: U$3.P$3 43.28,4.66 43.28,6.29 42.65,6.92 42.65,7.62 v42.34,7.62
GND  (via drill 0.35)
  Top 0.203: U9.2 23.82,7.8 R30.1 | U8.2 20,7.8 R29.1 | C14.1 10.41,24.53 v10.14,24.8 | U6.22 12.06,45.25 U6.91
  Bottom 0.152: U$1.G1 50.31,27.52 C10.2 | U$1.T6 47.13,26.74 C11.2
  Bottom 0.203: R37.1 14.8,48.96 U14.2 14.41,49.6 R4.1 13.39,49.47 13.39,49.74 12.83,50.3 12.83,50.82 12.89,50.88 U3.2 | R10.1 6.49,49.02 U5.2 6.04,49.71 U4.2 4.76,51.75 R9.1 | v10.14,24.8 10.16,24.78 10.16,24.77 | U6.14 18.14,47.82 U13.2
  other vias: 42.55,11.43 41.66,10.54 43.43,12.45 48.51,6.1 46.86,8.89 48.51,5.08 48.51,4.06 32.26,8.89 32.26,7.62 32.26,6.35 30.35,31.11 28.45,31.11 25.91,31.11 17.02,31.11 13.84,31.11 1.78,31.11 1.78,29.21 1.78,27.3 36.07,35.43 36.07,37.47 31.62,48.26 19.43,38.73 29.08,48.26 32.89,48.26 1.78,50.8 1.78,48.26 1.78,46.35 1.78,44.45 13.21,13.97 9.4,13.97 9.4,12.06 6.86,9.53 13.84,3.17 13.84,6.35 2.41,6.35 20.83,5.71 17.65,12.06 18.92,12.06 26.54,12.7 27.81,12.7 16.38,20.32 16.38,21.59 11.41,29.25 19.56,49.53 23.37,49.53 19.26,46.7 19.43,39.88 10.03,46.61
  pour Bottom: -1.65,54.23 55.5,54.23 55.5,-2.16 -2.79,-2.16 -2.79,53.85
  pour Top: -5.33,56.9 57.91,56.9 57.91,-3.3 -5.97,-3.3 -5.97,56.13
GPIO1  (via drill 0.35)
  Top 0.203: v18.8,51.44 18.8,50.16 17.06,48.43 U6.16
  Bottom 0.203: U4.1 2.86,51.75 R9.2 3.76,52.64 3.76,52.65 3.9,52.8 17.43,52.8 v18.8,51.44
GPIO2  (via drill 0.35)
  Top 0.203: U6.23 9.44,44.15 8.89,44.7 8.89,46.35 v7.75,47.5
  Bottom 0.203: U5.1 7.93,48.71 R10.2 7.49,47.76 v7.75,47.5
GPIO3  (via drill 0.35)
  Top 0.203: U6.24 9.19,43.05 v9.14,43.01
  Bottom 0.203: v9.14,43.01 8.87,43.28 7.38,43.28 4.7,45.96 4.7,46.74 5.07,47.11 5.6,47.11 5.87,46.84 7.77,46.84 9.52,45.09 12.45,45.09 12.45,45.86 12.67,46.09 12.67,46.9 12.52,47.04 12.51,47.04 R1.2 11.06,47.49 U1.1
GPIO4  (via drill 0.35)
  Top 0.203: U6.25 8.91,41.95 v8.35,42.51 | v5.21,47.75 5.6,47.75 5.67,47.68 7.03,47.68 7.49,48.13 8.01,48.13 8.43,47.71 11.89,47.71 v12.83,48.64
  Bottom 0.203: v8.35,42.51 7.94,42.93 7.23,42.93 4.35,45.81 4.35,46.89 v5.21,47.75 | v5.21,47.75 | R4.2 v12.84,48.65 v12.83,48.64 11.68,48.64 10.79,49.53 10.79,51.81 U3.1
GPIO5  (via drill 0.35)
  Top 0.203: U6.42 21.46,36.57 v21.59,36.7
  Bottom 0.203: R37.2 16.25,49.15 U14.1 17.72,48.58 20.07,48.58 22.25,46.4 22.25,42.92 22.37,42.81 22.37,42.28 21.59,41.5 v21.59,36.7
GPIO6  (via drill 0.35)
  Bottom 0.203: U6.19 16.04,46.7 17.72,45.02 | 17.72,45.02 17.78,44.96 | R35.2 20.51,46.54 | 20.51,46.54 19.62,47.43 U13.1 | 17.72,45.02 18.99,45.02 20.51,46.54
  other vias: 13.76,46.7
LOAD_ON  (via drill 0.35)
  Top 0.152: U7.11 11.74,15.17 v12.83,16.26 | v20.95,16.13 28.7,16.13 v33.02,20.45
  Bottom 0.152: v20.95,16.13 20.83,16.26 19.3,16.26 19.28,16.23 18.31,16.23 18.29,16.26 v12.83,16.26 | v33.02,20.45 35.78,20.45 U12.3
  other vias: 36.13,20.8
MCU_LED1  (via drill 0.35)
  Top 0.203: U7.30 21.04,15.17 v21.21,15 | v21.46,9.53 21.46,8.26 R29.2 21.45,7.37 U8.1
  Bottom 0.203: v21.21,15 21.46,14.75 v21.46,9.53
MCU_LED2
  Top 0.203: U7.29 21.57,14.37 23.88,12.06 24.77,12.06 25.4,11.44 25.4,10.26 25.27,10.13 R30.2 25.71,7.81 U9.1
N$1
  Top 0.203: U$2.P$1
  Top 0.305: 3.3,39.12 3.41,39.01 U$2.P$1
  Top 0.406: U6.17 15.96,48.05 14.61,49.4 13.97,49.4 12.32,49.4 11.08,48.16 8.62,48.16 8.2,48.59 7.3,48.59 6.84,48.13 5.86,48.13 5.51,48.49 4.9,48.49 3.46,47.04 3.46,41.43 2.79,40.77 2.79,39.62 3.3,39.12
N$2
  Top 0.203: R39.1 6.35,38.61 6.1,38.35 4.57,38.35 U$2.P$2
N$3
  Top 0.203: R40.1 6.22,37.59 6.1,37.72 U$2.P$3
N$4  (via drill 0.35)
  Top 0.203: LED1.C 8.64,49.91 v8.89,49.66
  Bottom 0.203: v8.89,49.66 9.33,50.09 U1.3
N$5
  Bottom 0.203: U2.2 8.61,26.45 R2.1
N$6
  Top 0.203: LED1.A 9.89,50.81 R7.1
N$7  (via drill 0.35)
  Top 0.203: U6.12 21.46,44.07 v20.95,43.56 | v6.1,45.84 5.96,45.84 5.21,45.09 R15.2
  Bottom 0.203: v20.95,43.56 20.71,43.56 20.07,42.93 17.78,42.93 16.36,44.35 9.25,44.35 7.76,45.84 v6.1,45.84
N$8  (via drill 0.35)
  Top 0.203: U6.13 20.36,44.11 v19.81,43.56 | v5.33,46.48 5.27,46.55 4.19,45.47 R14.2
  Bottom 0.203: v19.81,43.56 17.65,43.56 16.51,44.7 9.4,44.7 7.62,46.48 v5.33,46.48
N$9  (via drill 0.35)
  Bottom 0.203: LED4.C 6.99,51.32 U5.3
  other vias: 6.22,50.56
N$10
  Top 0.203: U8.3 LED7.C
N$11
  Top 0.203: LED4.A 7.47,50.81 R12.1
N$12
  Top 0.762: U6.56 X1.3
N$13
  Top 0.203: U6.9 24.76,48.76 R13.2
N$14  (via drill 0.35)
  Top 0.203: v11.56,50.04 v11.56,50.05 LED2.C
  Bottom 0.203: v11.56,50.04 11.56,49.98 U3.3
N$15
  Top 0.203: LED2.A 12.3,50.81 R8.1
N$16
  Top 0.203: R31.1 19.93,1.79 LED7.A
N$17  (via drill 0.35)
  Top 0.203: LED3.C v3.81,49.66
  Bottom 0.203: v3.81,49.66 U4.3
N$18  (via drill 0.35)
  Top 0.203: v19.68,41.78 20.83,42.93 21.22,42.93 22.56,44.27 U6.11 | v6.76,45.21 6.22,44.67 R16.2
  Bottom 0.203: v19.68,41.78 18.29,41.78 16.08,43.99 10.67,43.99 9.1,43.99 7.89,45.21 v6.76,45.21
N$19  (via drill 0.35)
  Top 0.203: U6.10 23.21,46.26 23.21,44.42 20.34,41.55 v20.34,41.02
  Bottom 0.203: R17.2 8.28,44.31 8.96,43.64 15.93,43.64 18.54,41.02 19.45,41.02 v20.34,41.02
  other vias: 7.24,44.31
N$21
  Top 0.203: LED3.A 5.06,50.81 R11.1
N$22
  Bottom 0.152: U11.5 37.75,7.53 R34.2
N$23
  Top 0.203: LED8.C U9.3
N$24  (via drill 0.35)
  Top 0.203: R33.1 36.2,4.57 v34.92,5.84
  Bottom 0.203: v34.92,5.84 34.92,7.84 U11.1
N$25
  Top 0.203: LED9.C 36.45,1.79 R33.2
N$26
  Top 0.203: R32.1 LED8.A
N$27  (via drill 0.35)
  Top 0.203: v7.24,42.16 R17.1
  Bottom 0.203: U2.14 7.96,41.44 v7.24,42.16
N$28  (via drill 0.35)
  Top 0.203: v6.22,42.16 v6.22,42.17 R16.1
  Bottom 0.203: U2.13 7.31,41.08 v6.22,42.16
N$29  (via drill 0.35)
  Top 0.203: v5.21,42.29 R15.1
  Bottom 0.203: U2.12 6.66,40.84 v5.21,42.29
N$30  (via drill 0.35)
  Top 0.203: v4.19,42.16 R14.1
  Bottom 0.203: U2.11 6.01,40.98 5.33,41.66 4.7,41.66 v4.19,42.16
N$31
  Bottom 0.203: U2.1 10.41,28.89 R5.1
N$32
  Bottom 0.203: U2.7 5.36,25.82 R3.2
N$33
  Bottom 0.203: U2.8 4.02,27.05 R6.2
N$34
  Top 0.203: IC1.9 46.09,10.43 | 46.09,10.43 R22.1 | S3.P$1 51.6,10.38 50.67,11.3 46.48,11.3 46.09,10.91 46.09,10.43
N$35
  Top 0.203: IC1.6 43.64,9.03 43.64,8.4 44.2,7.84 44.2,6.34 44.57,5.97 45.09,5.97 45.47,6.35 46.99,6.35 48.26,7.62 48.26,9.53 47.37,10.41 R22.2
N$36
  Top 0.203: R25.1 LED6.C
N$37
  Top 0.203: R23.2 46.86,13.84 45.97,14.73 43.05,14.73 42.55,14.22 IC1.18
N$38
  Top 0.203: LED5.C R23.1
N$39
  Top 0.203: IC1.19 42.05,14.49 42.67,15.11 R25.2
N$40
  Top 0.203: IC1.26 39.49,10.93 37.97,12.45 R24.2
N$41
  Top 0.203: R26.2 37.96,13.72 38.41,13.27 38.41,12.66 39.54,11.53 40.15,11.53 IC1.25
N$42
  Top 0.203: R18.1 10.23,19.34 U7.6
N$43  (via drill 0.35)
  Top 0.203: U7.7 9.39,18.19 v9.39,19.29
  Bottom 0.203: v9.39,19.29 9.39,21.33 R19.1
  other vias: 9.27,21.44
N$44
  Top 0.203: IC1.24 40.15,12.03 39.54,12.03 38.76,12.81 38.76,14.1 37.87,14.99 R27.2
N$45
  Top 0.203: IC1.23 39.64,12.43 39.12,12.95 39.12,14.48 37.34,16.26 R28.2
N$46
  Top 0.203: R20.1 8.63,19.8 U7.8
N$47
  Top 0.203: U7.9 7.25,19.04 5.84,20.45 R21.1
N$48
  Top 0.203: U7.2 13.43,20.39 13.85,20.81 13.85,22.76 Y1.P$2
N$49
  Top 0.203: U7.3 12.7,18.22 Y1.P$1
N$50  (via drill 0.35)
  Top 0.203: v17.78,50.16 16.27,50.16 LED10.C
  Bottom 0.203: U13.3 17.84,50.22 v17.78,50.16
N$51
  Top 0.203: LED10.A 17,50.94 R36.1
N$52  (via drill 0.35)
  Bottom 0.203: LED11.C 14.31,50.56 U14.3
  other vias: 13.46,50.56
N$53
  Top 0.203: LED11.A 14.71,50.81 R38.1
N$54
  Top 0.203: U6.28 10.57,38.61 R39.2
N$55
  Top 0.203: U6.29 8.03,37.55 R40.2
N$56
  Top 0.203: U7.22 12.63,7.68 R41.2
N$57
  Top 0.203: U7.21 11.83,7.63 R42.2
POWER_IN  (via drill 0.35)
  Top 0.203: R31.2 v19.68,3.81 | R32.2 22.84,2.8 v22.84,3.05
  Top 0.406: CN1.1 28.45,6.48 v27.81,6.48
  Top 0.61: CN1.1 30.11,11.79 J3.2 29.84,13.84 33.89,17.89 C19.1 34.23,19.26 U12.1
  Bottom 0.203: v19.68,3.81 22.08,3.81 v22.84,3.05
  Bottom 0.406: v27.81,6.48 26.63,6.48 25.25,5.1 | 25.25,5.1 U10.1 | 25.25,5.1 25.25,5.61 24.77,6.1 23.75,6.1 23.18,5.53 U10.3 22.84,4.59 v22.84,3.05
  Bottom 0.61: U11.3 33.63,9.97 C18.1 30.77,9.87 29.84,10.79 J3.2
POWER_ON  (via drill 0.35)
  Top 0.152: S2.P$1 4.08,8.4 5.08,9.4 5.08,13.08 v4.83,13.34
  Top 0.203: U6.15 18.16,45.09 18.67,44.59 18.67,44.06 18.16,43.55 18.16,39.75 16.27,37.86 v16.27,36.58 | v14.61,28.32 13.59,27.3 7.11,27.3 4.83,25.02 4.83,23.24 3.39,21.8 2.73,21.8 2.59,21.66 2.59,20.55 2.73,20.4 3.35,20.4 4.45,19.3 4.45,17.91 v5.52,16.83 6.38,15.97 U7.10
  Bottom 0.152: v4.83,13.34 4.83,16.13 v5.52,16.83
  Bottom 0.203: v16.27,36.58 16.27,29.98 v14.61,28.32
R404M_RESET  (via drill 0.35)
  Top 0.203: U7.12 3.72,14.37 S1.P$1 3.34,15.84 v3.3,15.88 | U6.18 14.86,47.37 v14.1,48.13 | v18.03,44.32 18.03,44.07 17.8,43.84 17.8,40.16 15.49,37.85 v15.49,36.07 | v13.46,28.07 13.08,27.69 6.73,27.69 4.19,25.15 4.19,23.5 3.17,22.48 v2.92,22.48
  Bottom 0.203: v18.03,44.32 17.91,44.32 16.16,46.07 13.5,46.07 13.13,46.44 13.13,46.96 14.1,47.93 v14.1,48.13 | v15.49,36.07 15.49,30.1 v13.46,28.07 | v2.92,22.48 2.92,16.26 v3.3,15.88
SIM_CLK  (via drill 0.35)
  Top 0.203: v20.26,29.28 20.26,29.6 18.32,31.54 17.66,31.54 17,32.2 17,32.74 U6.38
  Bottom 0.203: v20.26,29.28 43.75,29.28 44.7,30.23 48.51,30.23 49.02,29.72 49.01,29.7 C10.1 49.01,26.67 U$1.C3
SIM_IO  (via drill 0.35)
  Top 0.203: v21.65,28.39 21.65,28.78 18.1,32.33 18.1,32.74 U6.39
  Bottom 0.203: v21.65,28.39 22.23,27.81 46.1,27.81 | U$1.C7 46.43,27.48 46.1,27.81 | 46.1,27.81 45.83,28.08 C11.1
SIM_RST  (via drill 0.35)
  Top 0.203: U6.40 19.26,31.67 23.62,27.31 23.62,26.92 v24.38,26.16
  Bottom 0.203: v24.38,26.16 24.77,26.16 34.02,16.92 46.33,16.92 48.26,14.99 48.23,14.96 U$1.C2 48.23,12.36 C8.1
SWCLK  (via drill 0.35)
  Top 0.203: U7.24 20.33,9.79 22.1,11.56 24.38,11.56 v24.51,11.43
  Bottom 0.203: v24.51,11.43 24.51,15.62 20.19,19.94 J1.2
SWDIO  (via drill 0.35)
  Top 0.203: U7.23 13.43,8.79 13.97,8.26 19.3,8.26 21.2,10.16 21.21,10.16 22.1,11.05 24,11.05 24.25,10.8 24.49,10.8 v24.77,10.52
  Bottom 0.203: v24.77,10.52 25.15,10.9 25.15,16.13 J1.3
UART_CTS  (via drill 0.35)
  Top 0.203: R18.2 v8.13,24.26 8.13,24.64 10.19,26.7 12.92,26.7 v13.08,26.54 | R28.1 v34.29,16.26
  Bottom 0.203: U2.4 7.31,25.58 8.13,24.77 v8.13,24.26 | v34.29,16.26 33.98,16.56 33.09,16.56 23.28,26.36 18.3,26.36 18.25,26.42 13.21,26.42 v13.08,26.54
UART_RTS  (via drill 0.35)
  Top 0.203: v9.27,24.38 R19.2 | R27.1 34.27,14.99 v33.46,15.8 | v21.46,25.73 20.91,26.29 13.86,26.29 v13.1,25.53
  Bottom 0.203: U2.3 7.96,25.7 v9.27,24.38 9.66,24.38 9.88,24.17 10.75,24.17 10.79,24.13 11.31,24.13 11.56,24.38 11.96,24.38 v13.1,25.53 | v33.46,15.8 33.06,16.2 32.94,16.2 23.41,25.73 v21.46,25.73
UART_RXD  (via drill 0.35)
  Top 0.203: v5.84,23.88 R21.2 | R26.1 34.26,13.72 v32.62,15.35
  Bottom 0.203: U2.6 6.01,24.04 v5.84,23.88 6.09,23.62 8.39,23.62 8.51,23.75 16.64,23.75 16.76,23.75 24.23,23.75 v32.62,15.35
UART_TXD  (via drill 0.35)
  Top 0.203: v6.86,24.26 6.99,24.13 R20.2 | R24.1 34.16,12.45 v32,14.61 | v21.59,23.11 19.85,23.11 19.29,23.67 17.2,23.67 16.38,22.86 15.37,22.86 v15.11,23.11
  Bottom 0.203: U2.5 6.66,24.45 v6.86,24.26 | v32,14.61 31.75,14.86 31.75,15.72 24.36,23.11 v21.59,23.11 | v15.11,23.11 7.66,23.11 R20.2
  other vias: 6.99,22.44
USB_DM
  Top 0.203: U$4.P$2 12.05,6.12 R42.1
USB_DP
  Top 0.203: U$4.P$3 12.7,6.36 R41.1
V_INT  (via drill 0.35)
  Top 0.203: v20.96,38.35 v23.37,38.35 | v30.23,48.39 30.23,46.74 U6.4
  Bottom 0.203: U2.15 8.61,35.3 C1.1 8.88,36.69 9.4,37.21 19.82,37.21 v20.96,38.35 | v23.37,38.35 26.16,38.35 30.23,42.42 v30.23,48.39
VBUS  (via drill 0.35)
  Top 0.203: LED9.A 37.48,3.3 40.64,3.3 41.4,2.54 41.4,2.29 43.56,2.29 v44.45,3.17
  Top 0.254: v44.83,6.6 44.83,7.61 C12.1 44.82,7.76 44.44,8.14 | IC1.7 44.05,8.53 44.44,8.14 | IC1.8 45.34,9.44 45.34,8.76 44.72,8.14 44.44,8.14
  Bottom 0.203: v44.45,3.17 44.48,3.21 44.48,4.7
  Bottom 0.254: 44.86,6.45 44.86,6.08 44.48,5.7 44.48,4.7 U$3.P$1
  Bottom 0.61: U11.4 38.36,9.36 C16.1 39.59,9.14 43.31,9.14 44.83,7.62 v44.83,6.6 44.83,6.48 44.86,6.45
VSIM  (via drill 0.35)
  Top 0.203: U6.41 20.36,31.07 v24.26,27.18
  Bottom 0.203: v24.26,27.18 34.16,17.27 46.99,17.27 49.15,15.11 49.15,13.86 U$1.C1 49.15,13.83 49.15,12.83 49.78,12.19 C7.1 C9.1